# EAGLE design DualTC (EAGLE 9.6.2)
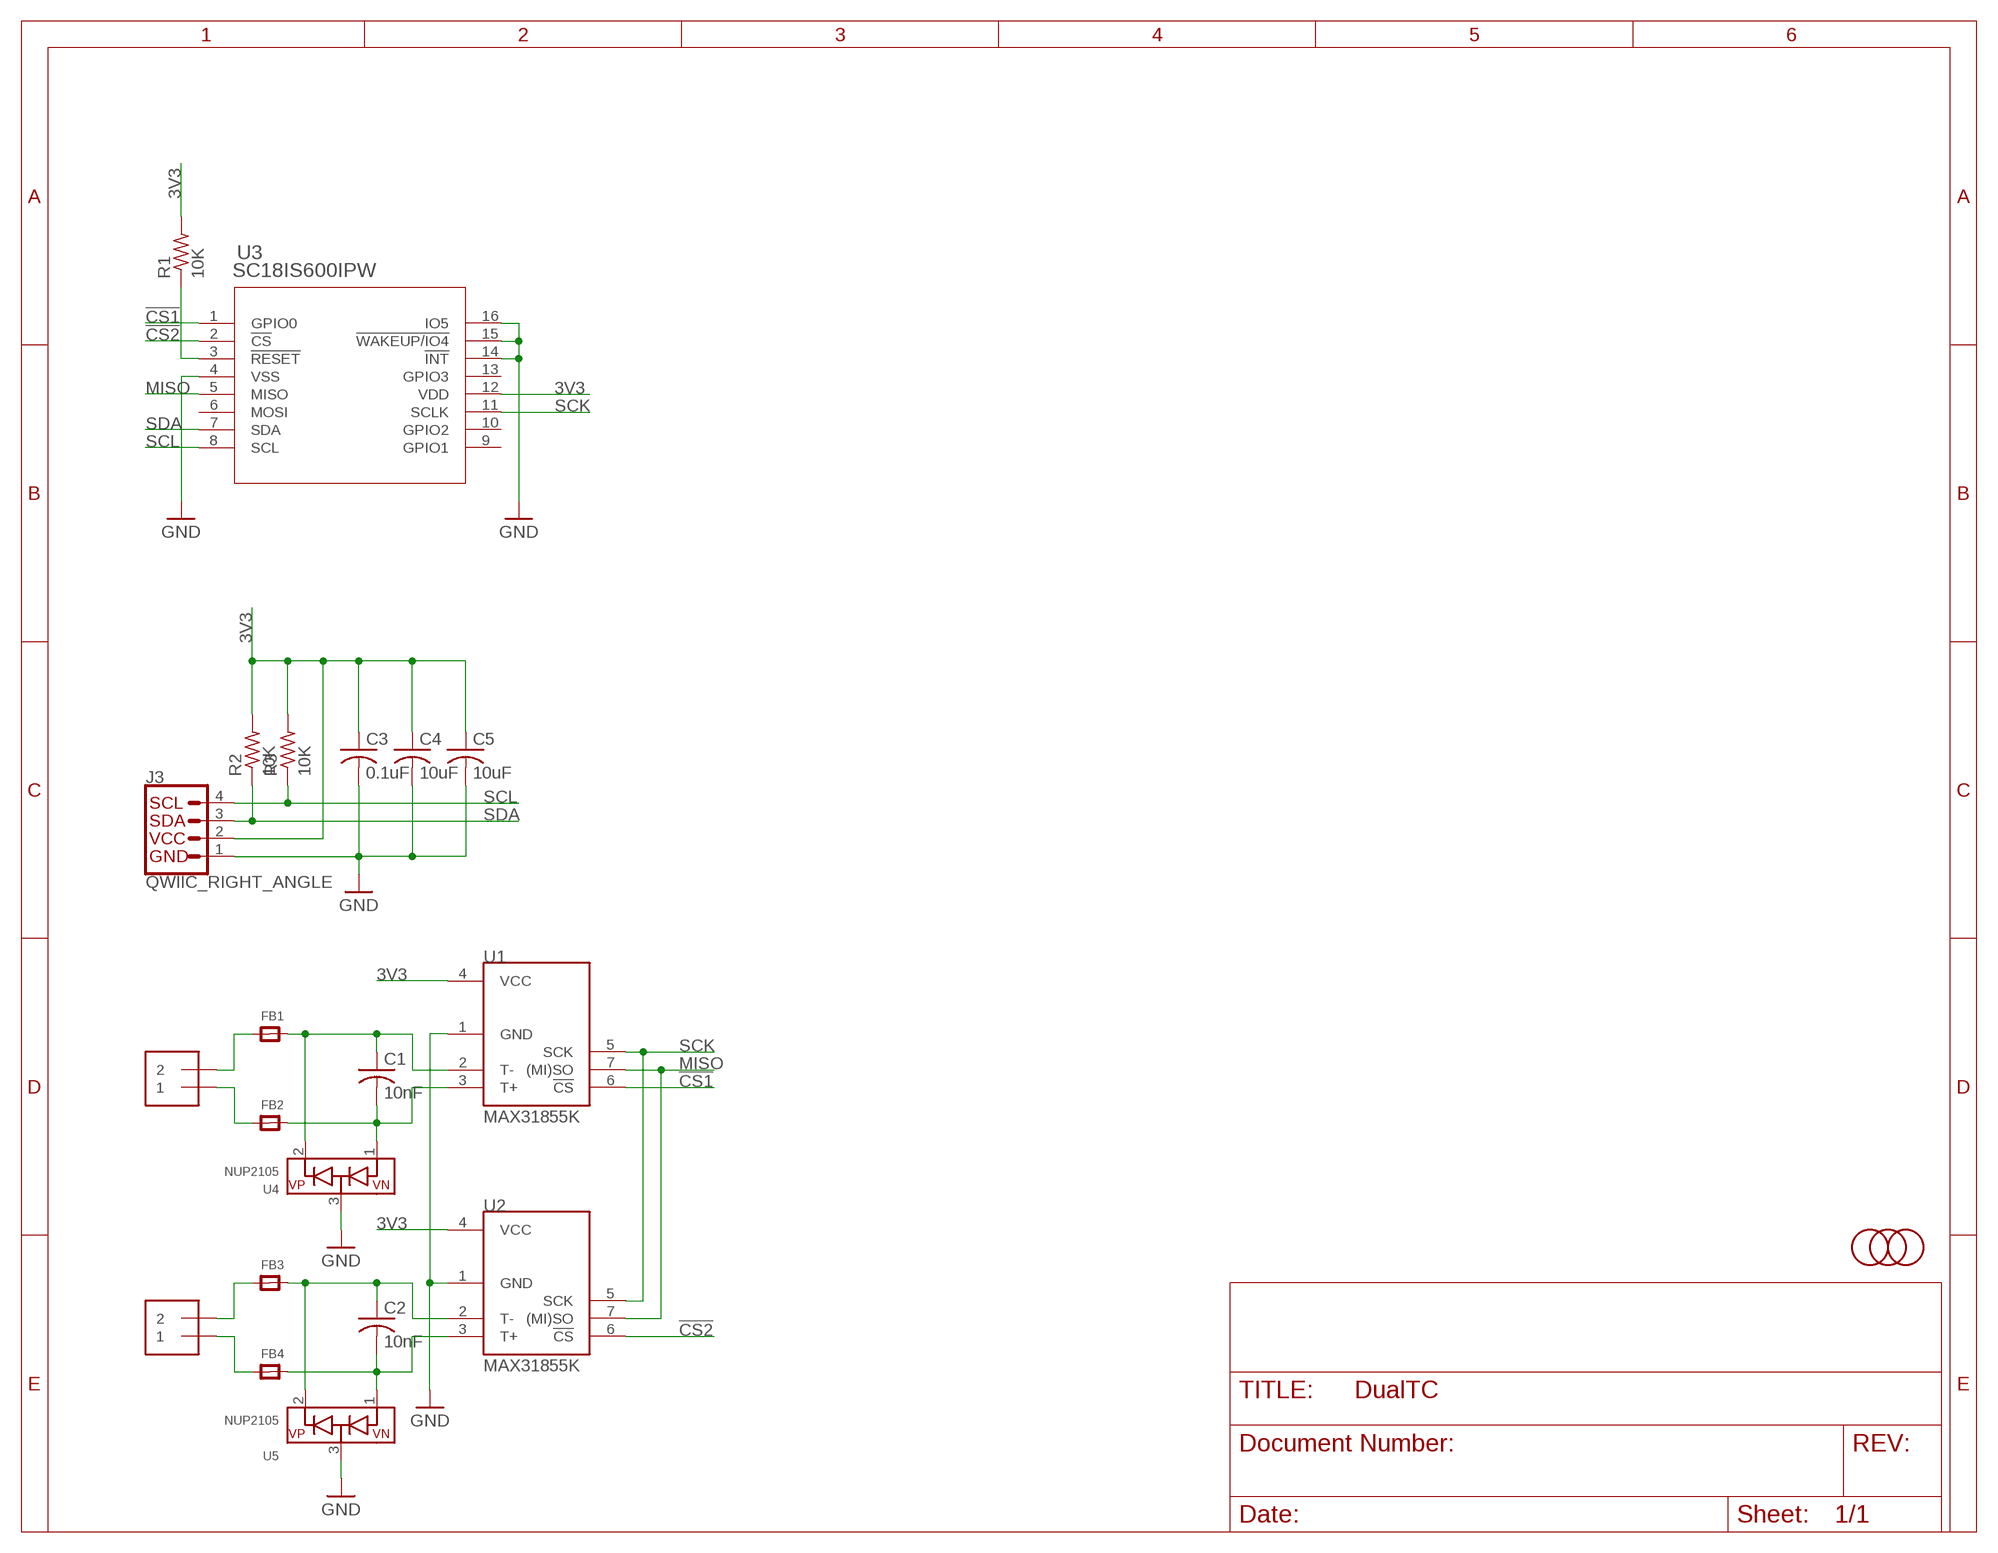
[diagram p0: schematic, sheet 1]

## Parts
C1  10nF  C-USC0603  [C0603]
C2  10nF  C-USC0603  [C0603]
C3  0.1uF  C-USC0603  [C0603]
C4  10uF  C-USC0603  [C0603]
C5  10uF  C-USC0603  [C0603]
FB1  FERRITE  [0603]
FB2  FERRITE  [0603]
FB3  FERRITE  [0603]
FB4  FERRITE  [0603]
J1  1X2-3.5MM  [1X2-3.5MM]
J2  1X2-3.5MM  [1X2-3.5MM]
J3  QWIIC_RIGHT_ANGLE  QWIIC_CONNECTORJS-1MM  [JST04_1MM_RA]
R1  10K  R-US_R0603  [R0603]
R2  10K  R-US_R0603  [R0603]
R3  10K  R-US_R0603  [R0603]
U1  MAX31855K  [SO08]
U2  MAX31855K  [SO08]
U3  SC18IS600IPW  [SOT403-1_NXP]
U4  NUP2105  ESDDIODEARRAY_SINGLE_UNIDIR  [SOT23-WIDE]
U5  NUP2105  ESDDIODEARRAY_SINGLE_UNIDIR  [SOT23-WIDE]
U$1  FIDUCIAL  [FIDUCIAL_1MM]
U$2  FIDUCIAL  [FIDUCIAL_1MM]
U$3  FIDUCIAL  [FIDUCIAL_1MM]

## Nets
3V3: C3.1 C4.1 C5.1 J3.2 R1.2 R2.2 R3.2 U1.4(VCC) U2.4(VCC) U3.12(VDD)
!CS1: U1.6(!CS) U3.1(GPIO0)
!CS2: U2.6(!CS) U3.2(!CS)
GND: C3.2 C4.2 C5.2 J3.1 U1.1(GND) U2.1(GND) U3.4(VSS) U3.14(!INT) U3.15(!WAKEUP/IO4) U3.16(IO5) U4.3(IO) U5.3(IO)
MISO: U1.7((MI)SO) U2.7((MI)SO) U3.5(MISO)
N$1: FB3.1 J2.2
N$2: FB4.1 J2.1
N$3: C2.1 FB3.2 U2.2(T-) U5.2(SUPPLYPIN)
N$4: C2.2 FB4.2 U2.3(T+) U5.1(GNDPIN)
N$5: FB1.1 J1.2
N$6: C1.1 FB1.2 U1.2(T-) U4.2(SUPPLYPIN)
N$7: FB2.1 J1.1
N$8: C1.2 FB2.2 U1.3(T+) U4.1(GNDPIN)
N$11: R1.1 U3.3(!RESET)
SCK: U1.5(SCK) U2.5(SCK) U3.11(SCLK)
SCL: J3.4 R3.1 U3.8(SCL)
SDA: J3.3 R2.1 U3.7(SDA)
Unconnected: U3.6(MOSI) U3.9(GPIO1) U3.10(GPIO2) U3.13(GPIO3)

## Library data of the parts
C1 C2 = rcl:C-US: CAPACITOR, American symbol; LCSC: C100042; SPICEPREFIX: C
C3 = rcl:C-US: CAPACITOR, American symbol; LCSC: C14663; SPICEPREFIX: C
C4 C5 = rcl:C-US: CAPACITOR, American symbol; LCSC: C86275; SPICEPREFIX: C
FB1-FB4 = microbuilder:FERRITE: Ferrite Bead 0603 MMZ1608B121C - 120 Ohm @ 100MHz, 600mA, 0.15 Ohm DC Resistance - Digikey: 445-2164-1-ND BK1608HW121-T - 120 Ohm, 600mA Ferrite Chip - Digikey: 587-1876-2-ND 0805 HZ0805B272R-10 - 2.7K Ohm @ 100MHz, 200mA, 0.8 Ohm DC Resistance - Digikey: 240-2504-1-ND (see also Murata BLM21BD272SN1L) MMZ2012Y152B - 1.5K Ohm @ 100MHz, 500mA, 0.4 Ohm DC Resistance - Digikey: 445-1560-1-ND - Mainly for high frequency (80-400MHz) MMZ2012R102A - 1K Ohm @ 100MHz, 500mA, 0.3 Ohm DC Resistance - Digikey: 445-1555-2-ND - More general purpose (10-200MHz); LCSC: C883591
J1 J2 = adafruit:1X2: 3.5mm Terminal block http://www.ladyada.net/library/pcb/eaglelibrary.html; LCSC: C474892
J3 = SparkFun-Connectors:QWIIC_CONNECTOR: SparkFun I2C Standard Qwiic Connector An SMD 1mm pitch JST connector makes it easy and quick (get it? Qwiic?) to connect I2C devices to each other. The Qwiic system <http://www.sparkfun.com/qwiic> enables fast and solderless connection between popular platforms and various sensors and actuators. We carry 200mm <https://www.sparkfun.com/products/14204>, 100mm <https://www.sparkfun.com/products/14205>, 50mm <https://www.sparkfun.com/products/14206>, and breadboard friendly <https://www.sparkfun.com/products/14207> Qwiic cables. We also offer 10 pcs strips <https://www.sparkfun.com/products/14323> the SMD connectors.; LCSC: C145956; PROD_ID: CONN-13694
R1-R3 = rcl:R-US_: RESISTOR, American symbol; LCSC: C98220; SPICEPREFIX: R
U1 U2 = SparkFun-IC-Conversion:MAX31855K: Cold-Junction-Compensated K-Thermocoupleto-Digital Converter (-270°C to +1800°C) The MAX31855K performs cold-junction compensation and digitizes the signal from a type-K thermocouple. The data is output in a 14-bit resolution, SPI™-compatible, read-only format. This converter resolves temperatures to 0.25°C, allows readings as high as +1800°C and as low as -270°C, and exhibits thermocouple accuracy of ±2°C for temperatures ranging from -200°C to +700°C for K-type thermocouples. Datasheet <https://cdn.sparkfun.com/datasheets/Sensors/Temp/MAX31855K.pdf> SparkFun Products SparkFun Thermocouple Breakout - MAX31855K <https://www.sparkfun.com/products/13266> (SEN-13266); LCSC: C52028; PROD_ID: IC-12578
U3 = discrete:SC18IS600IPW: SC18IS600 SPI to I²C-Bus Interface; COPYRIGHT: Copyright (C) 2022 Ultra Librarian. All rights reserved.; LCSC: C2678047; MANUFACTURER_PART_NUMBER: SC18IS600IPW; MFR_NAME: NXP
U4 U5 = microbuilder:ESDDIODEARRAY_SINGLE_UNIDIR: ESD Protection Diode Array - Single Channel Unidirectional SOT23-3 NUP1301,215 - Ultra low capacitance (0.6pF), Rev Voltage 80V, Forward Current: 215mA - Digikey: 568-6351-1-ND; LCSC: C920312
U$1-U$3 = adafruit:FIDUCIAL: For use by pick and place machines to calibrate the vision/machine, 1mm By microbuilder.eu

## Board
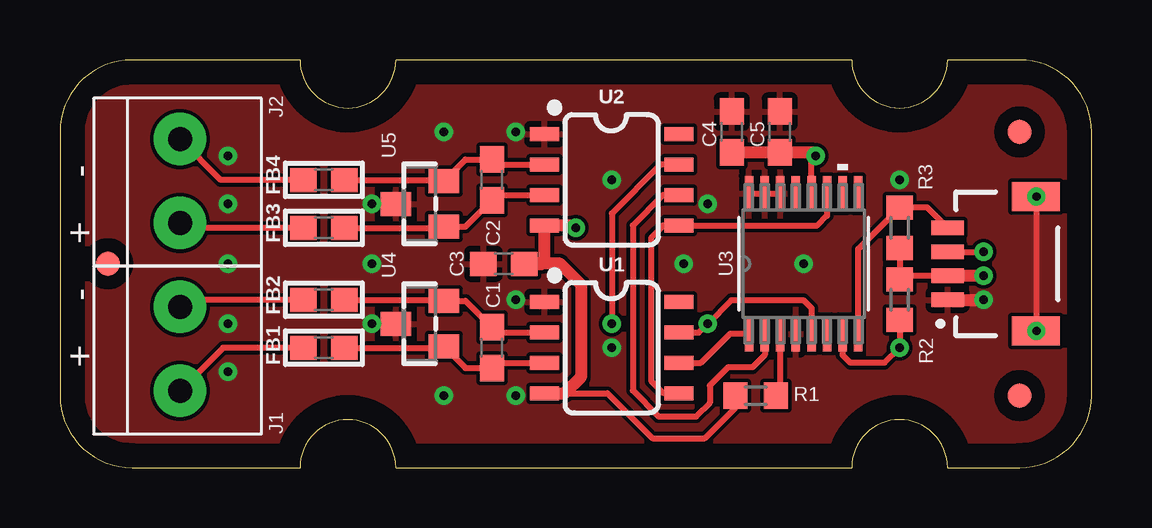
[diagram p1: board, top side]
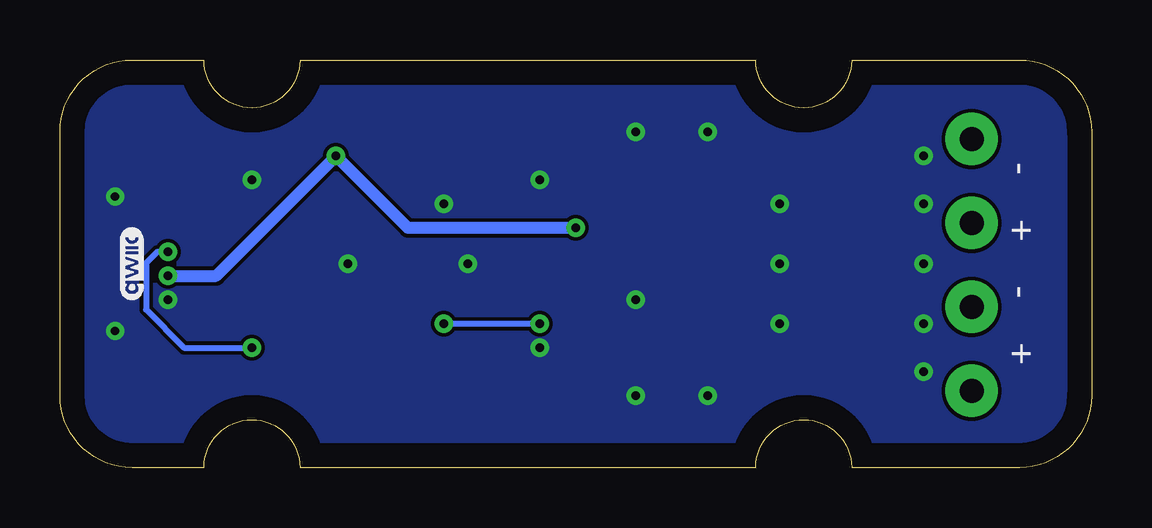
[diagram p2: board, bottom side, seen from below]

Size 43 x 17 mm. Coordinates in mm from the lower left corner, seen from the top.
Outline: 3,0 10,0 arc-180 14,0 33,0 arc-180 37,0 40,0 arc90 43,3 43,14 arc90 40,17 37,17 arc-180 33,17 14,17 arc-180 10,17 3,17 arc90 0,14 0,3 arc90 3,0
Copper layers (1*16): Top 0.035mm / dielectric 1.5mm / Bottom 0.035mm
Design rules "default": minimum track width 6mil, minimum drill 0.35mm, track to track 6mil, track to pad 6mil, pad to pad 6mil, via to via 6mil, smd to smd 6mil, copper to edge 40mil, drill to drill 6mil, minimum pad ring 10mil, minimum via ring 8mil, stop-mask expansion 4mil, vias tented up to drill 0mil, thermal gap 10mil

### Footprints (pad centres in the part's own frame; a part is rotated, then mirrored left to right if it is on the bottom)
C0603 = smd 1.1 x 1: 1 -0.85,0; 2 0.85,0
0603 = smd 1.1 x 1: 1 -0.85,0; 2 0.85,0
1X2-3.5MM = drill 1 pad 2.184: 1 1.8,0; 2 -1.7,0
JST04_1MM_RA = smd 0.6 x 1.35: 1 -1.5,0; 2 -0.5,0; 3 0.5,0; 4 1.5,0 | smd 1.2 x 2: NC1 2.8,-3.675; NC2 -2.8,-3.675
R0603 = smd 1 x 1.1: 1 -0.85,0; 2 0.85,0
SO08 = smd 0.6 x 1.2: 1 -1.905,-2.8; 2 -0.635,-2.8; 3 0.635,-2.8; 4 1.905,-2.8; 5 1.905,2.8; 6 0.635,2.8; 7 -0.635,2.8; 8 -1.905,2.8
SOT403-1_NXP = smd 1.473 x 0.356: 1 -2.921,2.275; 2 -2.921,1.625; 3 -2.921,0.975; 4 -2.921,0.325; 5 -2.921,-0.325; 6 -2.921,-0.975; 7 -2.921,-1.625; 8 -2.921,-2.275; 9 2.921,-2.275; 10 2.921,-1.625; 11 2.921,-0.975; 12 2.921,-0.325; 13 2.921,0.325; 14 2.921,0.975; 15 2.921,1.625; 16 2.921,2.275
SOT23-WIDE = smd 1 x 1.27: 1 -0.95,-1; 2 0.95,-1; 3 0,1
FIDUCIAL_1MM = smd 1 x 1: 1 0,0

### Placement (x,y rotation side)
C1  18,5 270 top
C2  18,12 270 top
C3  18.5,8.5 180 top
C4  28,14 90 top
C5  30,14 90 top
FB1  11,7 0 top
FB2  11,5 0 top
FB3  11,12 0 top
FB4  11,10 0 top
J1  5,5 270 top
J2  5,12 270 top
J3  37,8.5 90 top
R1  29,3 180 top
R2  35,7 90 top
R3  35,10 270 top
U1  23,5 270 top
U2  23,12 270 top
U3  31,8.5 90 top
U4  15,6 90 top
U5  15,11 90 top
U$1  2,8.5 0 top
U$2  40,14 0 top
U$3  40,3 0 top
U$4  [QWIIC_3MM]  40,8.5 90 bottom

### Tracks (layer width: path | path; a pad name or v marks a point on that pad's centre or on a via)
3V3  (via drill 0.35)
  Top 0.254: 21.04,3.1 22.81,3.1 24.69,1.22 26.88,1.22 28.15,2.49 R1.2 | R3.2 R2.2 | J3.2 35.15,8 | U3.12 31.32,12.82 v31.5,13
  Top 0.508: U1.4 21.04,3.1 21.71,3.77 21.71,7.63 20.84,8.5 C3.1 | C3.1 20.11,8.5 20.2,8.59 U2.4 21.41,10.1 v21.5,10 | C3.1 | 35.15,8 R2.2 | C4.1 C5.1 31.35,13.15 v31.5,13 | v38.5,8 J3.2
  Bottom 0.508: v21.5,10 28.5,10 v31.5,13 36.5,8 v38.5,8
!CS1
  Top 0.254: U1.6 26.72,4.37 27.93,5.58 U3.1
!CS2
  Top 0.254: U2.6 25.14,11.37 23.88,10.1 23.88,3.22 24.96,2.13 26.52,2.13 27.09,2.71 27.09,3.42 27.85,4.18 28.87,4.18 29.38,4.69 U3.2
GND  (via drill 0.35)
  Top 0.254: U3.16 U3.15 U3.14 | U5.3 v13,11 | U4.3 v13,6 | v40.7,11.3 v40.7,5.7
  Top 0.508: J3.1 v38.5,7
  other vias: 13,8.5 23,5 23,12 19,14 19,7 7,13 7,11 7,8.5 7,6 7,4 16,14 16,3 19,3 26,8.5 31,8.5 35,12 27,11
  pour Top: 0,0 43,0 43,17 0,17
  pour Bottom: 0,0 43,0 43,17 0,17
MISO  (via drill 0.35)
  Top 0.254: U2.7 25.04,12.63 23,10.6 v23,6 | U1.7 26.64,5.63 v27,6 27.98,6.99 30.99,6.99 31.32,6.65 U3.5
  Bottom 0.254: v23,6 v27,6
N$1
  Top 0.254: FB3.1 6.7,12 J2.2
N$2
  Top 0.254: FB4.1 5.2,10 J2.1
N$3
  Top 0.254: FB3.2 15.95,12 U5.2 16.9,12.85 C2.1 18.21,12.63 U2.2
N$4
  Top 0.254: FB4.2 15.95,10 U5.1 16.9,10.05 C2.2 18.21,11.37 U2.3
N$5
  Top 0.254: FB1.1 5.3,7 J1.2
N$6
  Top 0.254: FB1.2 15.95,7 U4.2 16.9,6.95 C1.1 18.21,5.63 U1.2
N$7
  Top 0.254: FB2.1 6.8,5 J1.1
N$8
  Top 0.254: FB2.2 15.95,5 U4.1 16.9,4.15 C1.2 18.21,4.37 U1.3
N$11
  Top 0.254: R1.1 30.02,3.19 U3.3
SCK
  Top 0.254: U1.5 25.16,3.1 24.67,3.59 24.67,9.61 25.16,10.1 U2.5 31.56,10.1 31.98,10.51 U3.11
SCL
  Top 0.254: J3.4 36.15,10.85 R3.1 33.27,9.12 U3.8
SDA  (via drill 0.35)
  Top 0.254: J3.3 v38.5,9 | R2.1 v35,5 34.37,4.37 32.95,4.37 32.62,4.69 U3.7
  Bottom 0.254: v38.5,9 38.94,9 39.41,8.53 39.41,6.58 37.83,5 v35,5

### Text on the board
tPlace: + - + -
bPlace: + - + -